# Altium schematic sheet QSPI Memory.SchDoc: QSPI Memory
size A4; Date: Not used; ApprovedBy: Not used; CheckedBy: Not used; Author: Not used; CompanyName: STMicroelectronics; DrawnBy: Not used; Engineer: Not used; Organization: Not used; Address1: Not used; Address2: Not used; Address3: Not used; Address4: Not used; DocumentNumber: Not used; Revision: Not used; SheetNumber: 8; SheetTotal: 22; CurrentTime: Not used; CurrentDate: Not used; Time: Not used; DocumentFullPathAndName: Not used; DocumentName: Not used; ModifiedDate: Not used; ImagePath: Not used; ProjectName: Not used; Application_BuildNumber: Not used
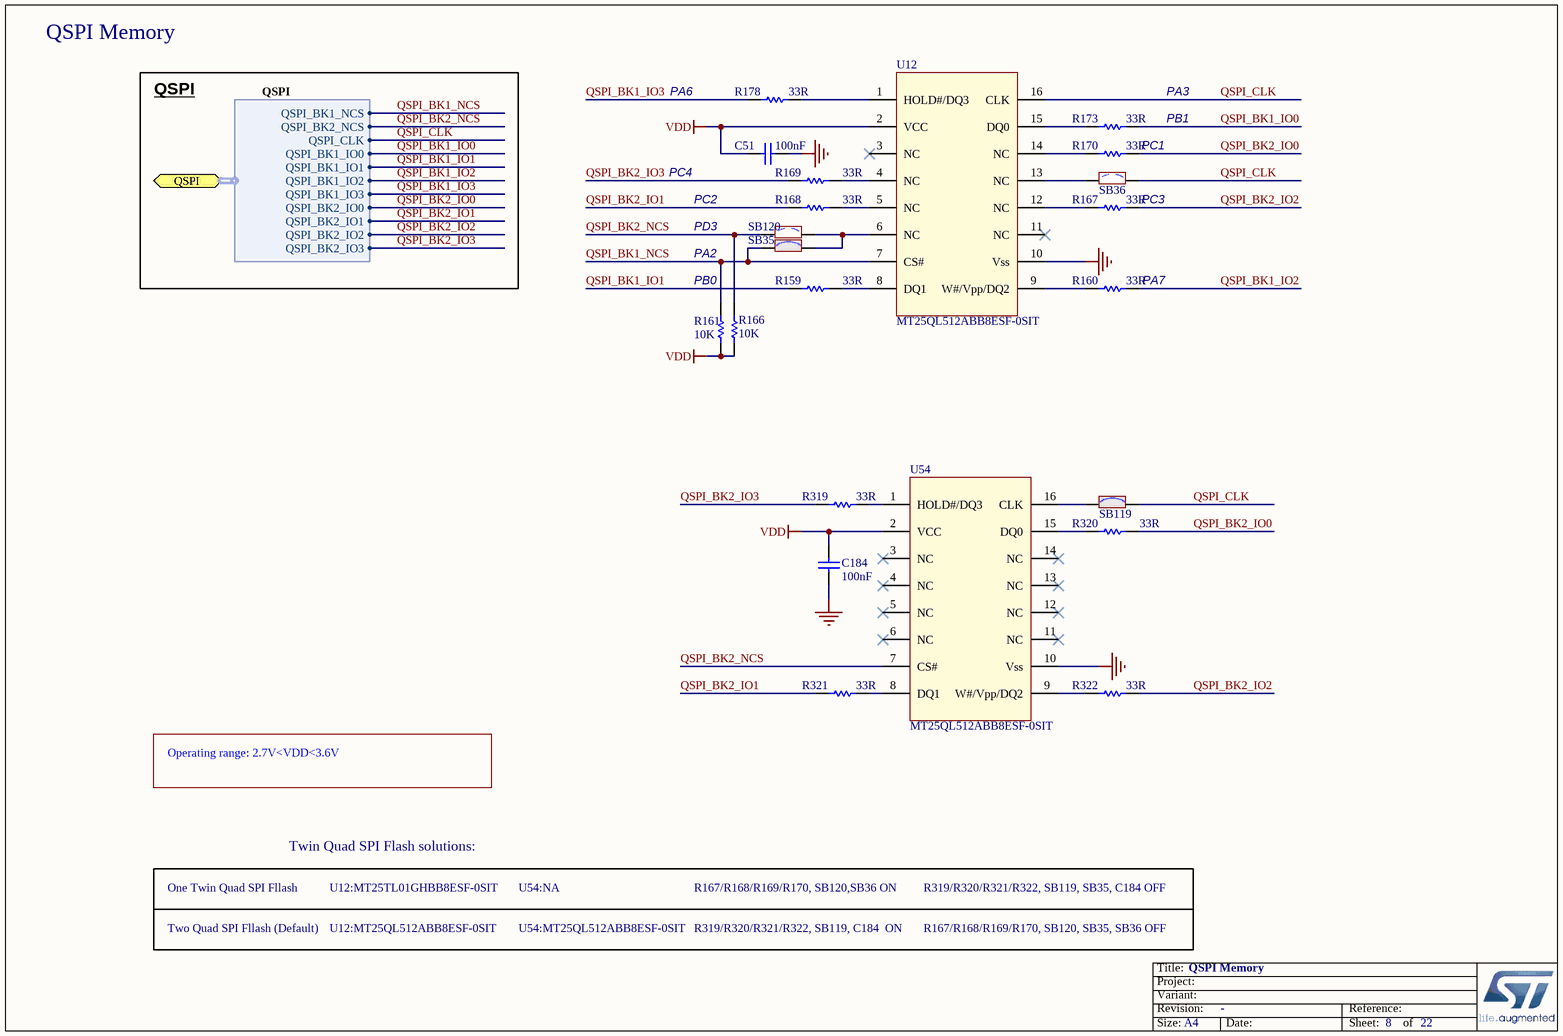
[diagram p0: QSPI Memory.SchDoc]

## Parts
C51  value 100nF  [C0402]  (hidden comment: Capacitor)
C184  value 100nF  [C0402]  (hidden comment: Capacitor)
R159  value 33R  [R0402]  (hidden comment: Resistor)
R160  value 33R  [R0402]  (hidden comment: Resistor)
R161  value 10K  [R0402]  (hidden comment: Resistor)
R166  value 10K  [R0402]  (hidden comment: Resistor)
R167  value 33R  [R0402]  (hidden comment: Resistor)
R168  value 33R  [R0402]  (hidden comment: Resistor)
R169  value 33R  [R0402]  (hidden comment: Resistor)
R170  value 33R  [R0402]  (hidden comment: Resistor)
R173  value 33R  [R0402]  (hidden comment: Resistor)
R178  value 33R  [R0402]  (hidden comment: Resistor)
R319  value 33R  [R0402]  (hidden comment: Resistor)
R320  value 33R  [R0402]  (hidden comment: Resistor)
R321  value 33R  [R0402]  (hidden comment: Resistor)
R322  value 33R  [R0402]  (hidden comment: Resistor)
SB35  SB_ON  [SOLDER-BRIDGE_R0603-0R]  (value not drawn)
SB36  SB_OFF  [SOLDER-BRIDGE_R0603-0R]  (value not drawn)
SB119  SB_ON  [SOLDER-BRIDGE_R0603-0R]  (value not drawn)
SB120  SB_OFF  [SOLDER-BRIDGE_R0603-0R]  (value not drawn)
U12  MT25QL512ABB8ESF-0SIT  [ICC_SOP2-SF_16P_10P3X7P5_P127]
U54  MT25QL512ABB8ESF-0SIT  [ICC_SOP2-SF_16P_10P3X7P5_P127]

## Ports
QSPI (harness QSPI)

## Harnesses
QSPI: QSPI_BK1_IO1, QSPI_BK1_IO0, QSPI_CLK, QSPI_BK1_NCS, QSPI_BK1_IO2, QSPI_BK1_IO3, QSPI_BK2_IO1, QSPI_BK2_IO0, QSPI_BK2_IO2, QSPI_BK2_IO3, QSPI_BK2_NCS

## Nets
GND: C51.1 C184.1 U12.10(Vss) U54.10(Vss)
VDD: C51.2 C184.2 R161.1 R166.1 U12.2(VCC) U54.2(VCC)
QSPI_BK1_IO0: R173.2 ; port QSPI.QSPI_BK1_IO0
QSPI_BK1_IO1: R159.1 ; port QSPI.QSPI_BK1_IO1
QSPI_BK1_IO2: R160.2 ; port QSPI.QSPI_BK1_IO2
QSPI_BK1_IO3: R178.1 ; port QSPI.QSPI_BK1_IO3
QSPI_BK1_NCS: R161.2 SB35.1 U12.7(CS#) ; port QSPI.QSPI_BK1_NCS
QSPI_BK2_IO0: R170.2 R320.2 ; port QSPI.QSPI_BK2_IO0
QSPI_BK2_IO1: R168.1 R321.1 ; port QSPI.QSPI_BK2_IO1
QSPI_BK2_IO2: R167.2 R322.2 ; port QSPI.QSPI_BK2_IO2
QSPI_BK2_IO3: R169.1 R319.1 ; port QSPI.QSPI_BK2_IO3
QSPI_BK2_NCS: R166.2 SB120.1 U54.7(CS#) ; port QSPI.QSPI_BK2_NCS
QSPI_CLK: SB36.2 SB119.2 U12.16(CLK) ; port QSPI.QSPI_CLK
NetR159_2: R159.2 U12.8(DQ1)
NetR160_1: R160.1 U12.9(W#/Vpp/DQ2)
NetR167_1: R167.1 U12.12(NC)
NetR168_2: R168.2 U12.5(NC)
NetR169_2: R169.2 U12.4(NC)
NetR170_1: R170.1 U12.14(NC)
NetR173_1: R173.1 U12.15(DQ0)
NetR178_2: R178.2 U12.1(HOLD#/DQ3)
NetR319_2: R319.2 U54.1(HOLD#/DQ3)
NetR320_1: R320.1 U54.15(DQ0)
NetR321_2: R321.2 U54.8(DQ1)
NetR322_1: R322.1 U54.9(W#/Vpp/DQ2)
NetSB35_2: SB35.2 SB120.2 U12.6(NC)
NetSB36_1: SB36.1 U12.13(NC)
NetSB119_1: SB119.1 U54.16(CLK)

Not connected (* = marked no-connect by the designer): U12 3(NC)* 11(NC)*; U54 3(NC)* 4(NC)* 5(NC)* 6(NC)* 11(NC)* 12(NC)* 13(NC)* 14(NC)*

## Notes on the sheet
- QSPI Memory
- QSPI
- PA6
- PA3
- (near C51) PC4
- PB1
- PC1
- PC2
- PD3
- PC3
- PB0
- PA2
- (near R160) PA7
- Operating range: 2.7V<VDD<3.6V
- Twin Quad SPI Flash solutions:
- One Twin Quad SPI Fllash
- U12:MT25TL01GHBB8ESF-0SIT
- U54:NA
- R167/R168/R169/R170, SB120,SB36 ON
- R319/R320/R321/R322, SB119, SB35, C184 OFF
- Two Quad SPI Fllash (Default)
- U12:MT25QL512ABB8ESF-0SIT
- U54:MT25QL512ABB8ESF-0SIT
- R319/R320/R321/R322, SB119, C184  ON
- R167/R168/R169/R170, SB120, SB35, SB36 OFF
- Title:
- Project:
- Size:
- Revision:
- Variant:
- A4
- -
- Date:
- Reference:
- Sheet:
- of

## Library data of the parts
C51 C184 = MCD-00006: Capacitor, MLCC, 100nF, 16V, X7R, 10%, 0402, T=0.5mm; Manufacturer_Part_Number: CC0402KRX7R7BB104; Manufacturer: YAGEO; Alternate_Manufacturer_Part_Number: GCM155R71C104KA55D; Alternate_Manufacturer: MURATA; Provided_By: SUBCO; Initial_Board_Reference: MB1274; Path: ws/MCD_ApplicationBoards/Lists/MCDPARTSdatabase; Item Type: Item; Internal_Part_Number: MCD-00006; Status: Released; Part_Type: Capacitor; Package: C0402; ComponentLink1Description: Datasheet; ComponentLink1URL: http://tunmcdsvn.tun.st.com/Component_Datasheet_Library/Trunk/Capacitors/Yageo_Multilayer_Capacitor_X7R_series_100pF_to_22uF
R159 R160 R167-R170 R173 R178 R319-R322 = MCD-00455: Resistor,33R,0402,1%,1/16W; Manufacturer_Part_Number: RC0402FR-0733RL; Manufacturer: YAGEO; Provided_By: SUBCO; Initial_Board_Reference: MBxxxx; Path: ws/MCD_ApplicationBoards/Lists/MCDPARTSdatabase; Item Type: Item; Internal_Part_Number: MCD-00455; Status: Released; Part_Type: Resistor; Package: R0402; ComponentLink1Description: Datasheet; ComponentLink1URL: http://tunmcdsvn.tun.st.com/Component_Datasheet_Library/Trunk/Resistors/Yageo_Resistor_RC0402-series
R161 R166 = MCD-00053: Resistor,10K,0402,1%,1/16W; Manufacturer_Part_Number: RC0402FR-0710KL; Manufacturer: YAGEO; Provided_By: SUBCO; Initial_Board_Reference: MB1274; Path: ws/MCD_ApplicationBoards/Lists/MCDPARTSdatabase; Item Type: Item; Internal_Part_Number: MCD-00053; Status: Released; Part_Type: Resistor; Package: R0402; ComponentLink1Description: Datasheet; ComponentLink1URL: http://tunmcdsvn.tun.st.com/Component_Datasheet_Library/Trunk/Resistors/Yageo_Resistor_RC0402-series
SB35 SB119 = MCD-00071: Solder Bridge ON; Part_Type: Mechanical; Manufacturer_Part_Number: RC0603JR-070RL; Manufacturer: YAGEO; Provided_By: SUBCO; Initial_Board_Reference: MB1274; Path: ws/MCD_ApplicationBoards/Lists/MCDPARTSdatabase; Item Type: Item; Internal_Part_Number: MCD-00071; Status: Released; ComponentLink1Description: Datasheet; Package: SB0603; ComponentLink1URL: http://tunmcdsvn.tun.st.com/Component_Datasheet_Library/Trunk/Resistors/Yageo_Resistor_RC0603-series
SB36 SB120 = MCD-00072: Solder Bridge OFF; Part_Type: Mechanical; Manufacturer_Part_Number: RC0603JR-070RL; Manufacturer: YAGEO; Provided_By: SUBCO; Initial_Board_Reference: MB1274; Path: ws/MCD_ApplicationBoards/Lists/MCDPARTSdatabase; Item Type: Item; Internal_Part_Number: MCD-00072; Status: Released; ComponentLink1Description: Datasheet; Package: SB0603; ComponentLink1URL: http://tunmcdsvn.tun.st.com/Component_Datasheet_Library/Trunk/Resistors/Yageo_Resistor_RC0603-series
U12 U54 = MCD-01128: Micron Serial NOR Flash Memory; Part_Type: IC; BMS_Part_Number: 9171976; Provided_By: SUBCO; Initial_Board_Reference: MB1381; Path: ws/MCD_ApplicationBoards/Lists/MCDPARTSdatabase; Item Type: Item; Internal_Part_Number: MCD-01128; Value: MT25QL512ABB8ESF-0SIT; Status: Footprint available; Manufacturer_Part_Number: MT25QL512ABB8ESF-0SIT; Manufacturer: MICRON; Package: SOIC16; ComponentLink1Description: Datasheet; ComponentLink1URL: http://tunmcdsvn.tun.st.com/Component_Datasheet_Library/Trunk/IC/Micron_NOR%20Flash_MT25QL512ABA8ESF-0SIT/Micron_NOR%20Flash_MT25QL512ABA8ESF-0SIT.pdf